# Altium schematic sheet Arduino_Nano + Potentiometers.schDoc
size A4; SheetNumber: 1; SheetTotal: 2
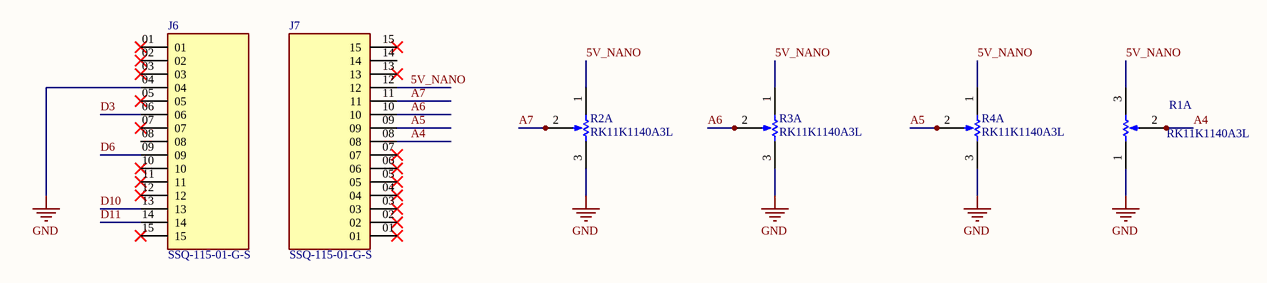
[diagram p0: Arduino_Nano + Potentiometers.schDoc]

## Parts
J6  SSQ-115-01-G-S  [SAMTEC_SSQ-115-01-G-S]
J7  SSQ-115-01-G-S  [SAMTEC_SSQ-115-01-G-S]
R1  RK11K1140A3L  [ALPS-RK11K1140A3L_V]  (part A of 2)
R2  RK11K1140A3L  [ALPS-RK11K1140A3L_V]  (part A of 2)
R3  RK11K1140A3L  [ALPS-RK11K1140A3L_V]  (part A of 2)
R4  RK11K1140A3L  [ALPS-RK11K1140A3L_V]  (part A of 2)

## Nets
GND: J6.04 R1.1(CCW) R2.3(CW) R3.3(CW) R4.3(CW)
5V_NANO: J7.12 R1.3(CW) R2.1(CCW) R3.1(CCW) R4.1(CCW)
A4: J7.08 R1.2(WIPER)
A5: J7.09 R4.2(WIPER)
A6: J7.10 R3.2(WIPER)
A7: J7.11 R2.2(WIPER)
D3: J6.06
D6: J6.09
D10: J6.13
D11: J6.14

Not connected (* = marked no-connect by the designer): J6 01* 02* 03* 05* 07* 08 10* 11* 12* 15*; J7 01* 02* 03* 04* 05* 06* 07* 13* 14 15*

## Library data of the parts
J6 J7 = SSQ-115-01-G-S: MF: Samtec; Package: None; Price: None; Availability: Unavailable; MP: SSQ-115-01-G-S; Value: *
R1-R4 = CMP-2000-06982-1: Rotary Potentiometer, 0.05 W, -10 to 70 degC, 4-Pin THD, RoHS; Manufacturer: ALPS; Power Rating: 1/20W; Rad Hard: No; Shaft Diameter: 6mm; Number of Turns: 1(Elec)|1(Mech)Turns; Tolerance: 20%; Resistance Value: 10KOhm; Packaging: Trays; Mounting: PanelMount/BracketMount; Type: Potentiometer; Datasheet Version: 05/2002; Mounting Technology: ThroughHole; Manufacturer URL: http://www.alps.com/e/; Datasheet URL: https://datasheet.ciiva.com/11830/0900766b8012456b-11830811.pdf; Package Reference: RK11K1140A3L; Operating Temperature: -10to70°C; Package Description: 4-Pin Through Hole Device, Body 15.7 x 11 mm, Pitch 2.5 mm